# Altium schematic sheet Sche_Main.SchDoc
size B
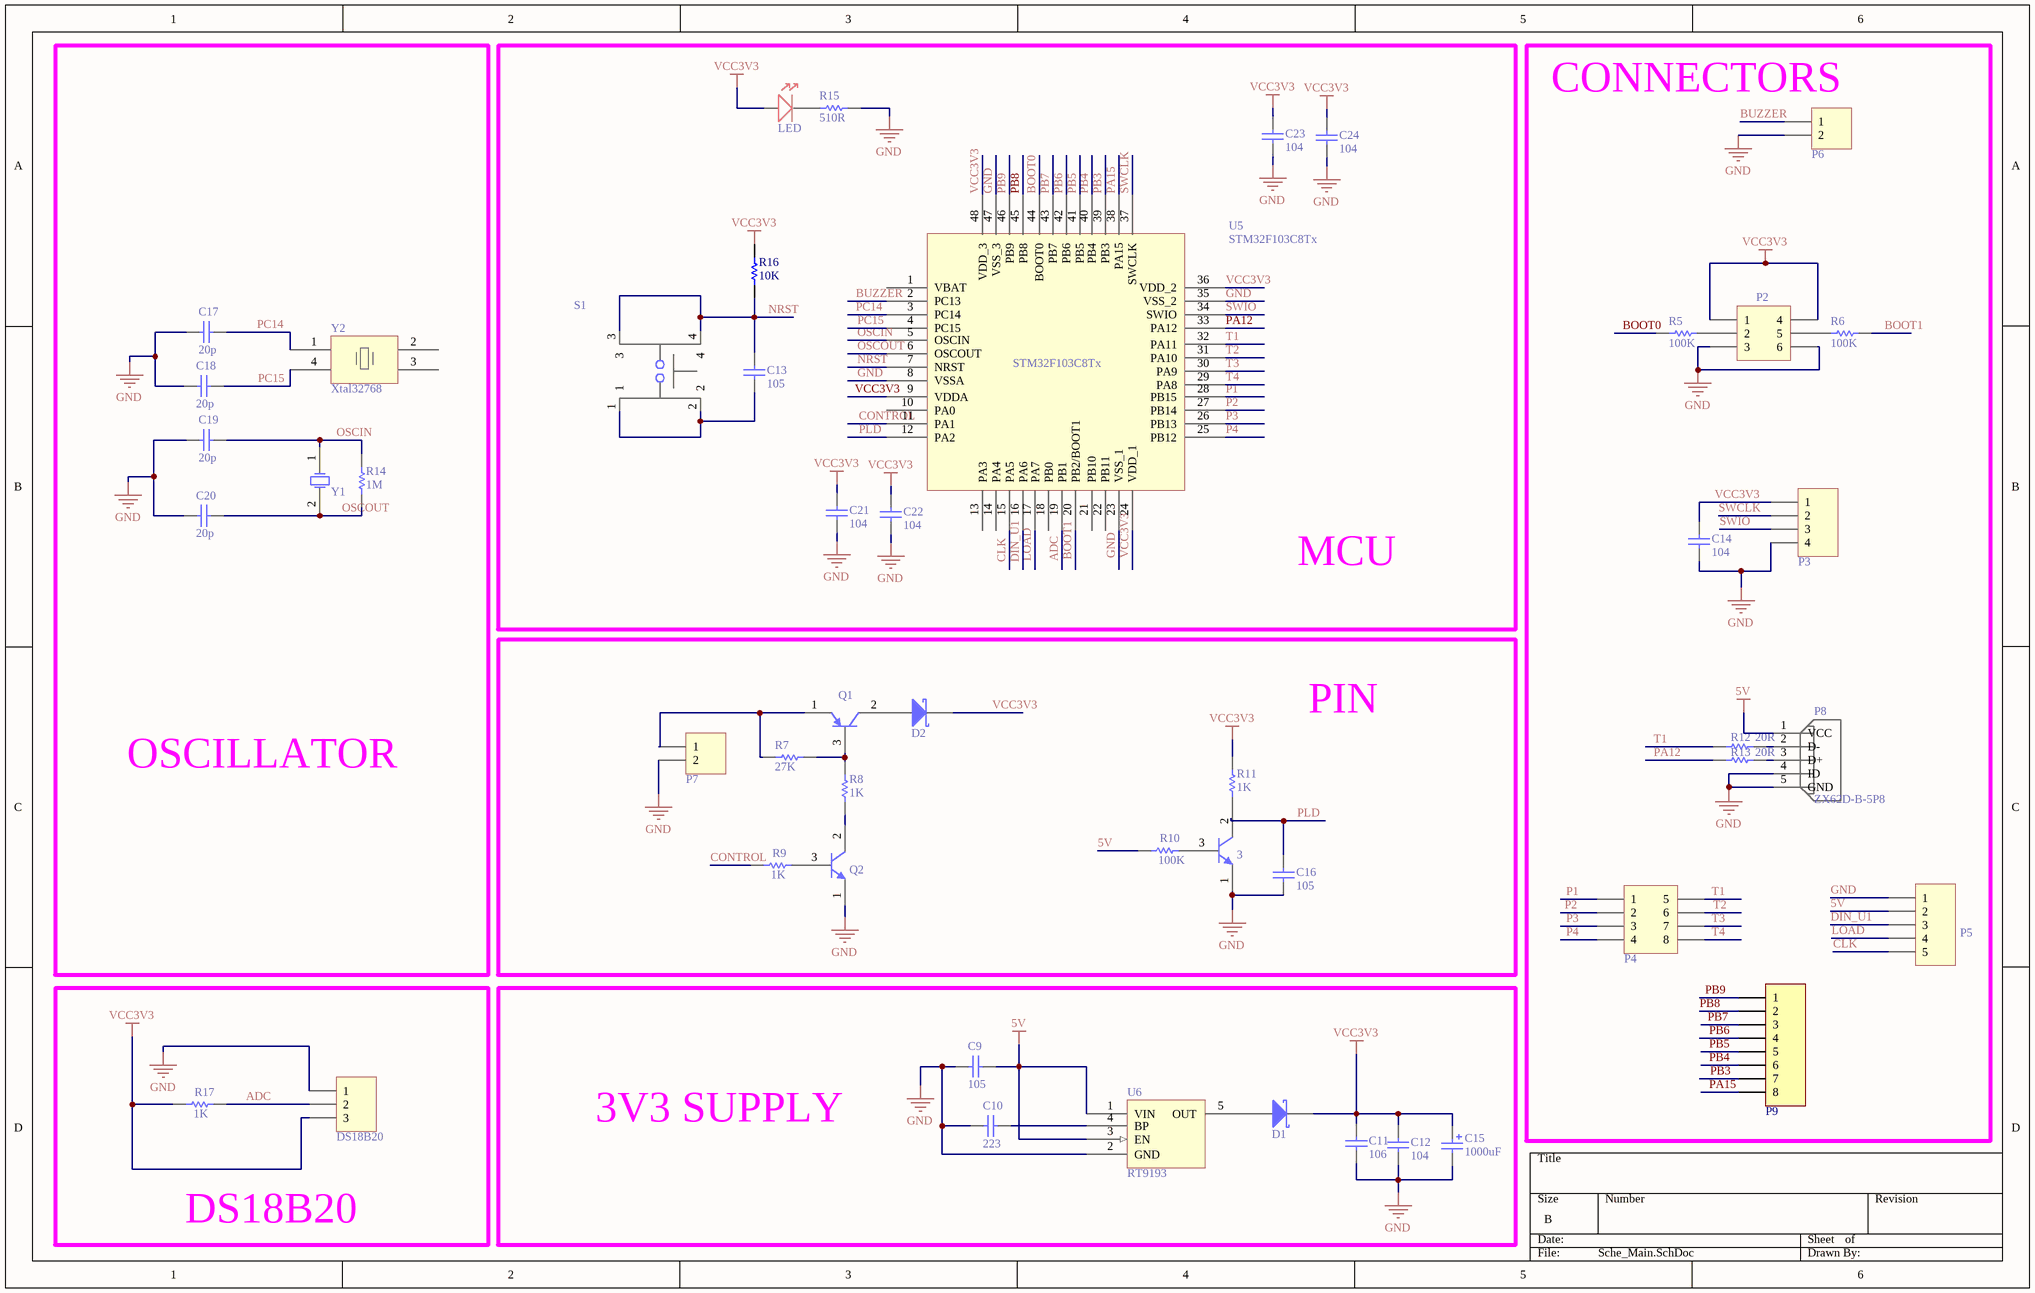
[diagram p0: Sche_Main.SchDoc]

## Parts
3  C1815  [SOT23B]  (value not drawn)
C9  value 105  [CAP-SM-0805]  (hidden comment: Cap Non-Pol SMD)
C10  value 223  [CAP-SM-0805]  (hidden comment: Cap Non-Pol SMD)
C11  value 106  [CAP-SM-0805]  (hidden comment: Cap Non-Pol SMD)
C12  value 104  [CAP-SM-0805]  (hidden comment: Cap Non-Pol SMD)
C13  value 105  [CAP-SM-0805]  (hidden comment: Cap Non-Pol SMD)
C14  value 104  [CAP-SM-0805]  (hidden comment: Cap Non-Pol SMD)
C15  value 1000uF  [CAP ALU SIZE B]  (hidden comment: Cap Pol SMD)
C16  value 105  [CAP-SM-0805]  (hidden comment: Cap Non-Pol SMD)
C17  value 20p  [CAP-SM-0805]  (hidden comment: Cap Non-Pol SMD)
C18  value 20p  [CAP-SM-0805]  (hidden comment: Cap Non-Pol SMD)
C19  value 20p  [CAP-SM-0805]  (hidden comment: Cap Non-Pol SMD)
C20  value 20p  [CAP-SM-0805]  (hidden comment: Cap Non-Pol SMD)
C21  value 104  [CAP-SM-0805]  (hidden comment: Cap Non-Pol SMD)
C22  value 104  [CAP-SM-0805]  (hidden comment: Cap Non-Pol SMD)
C23  value 104  [CAP-SM-0805]  (hidden comment: Cap Non-Pol SMD)
C24  value 104  [CAP-SM-0805]  (hidden comment: Cap Non-Pol SMD)
D1  D Schottky  [SS34]  (value not drawn)
D2  D Schottky  [SS34]  (value not drawn)
DS18B20  Header 3  [QTO-92]  (value not drawn)
LED  KA-3528EC  [DIOM3228X21N]  (value not drawn)
P2  Header 3X2  [JP3x2]  (value not drawn)
P3  Header 4  [JP4]  (value not drawn)
P4  Header 4X2  [JP4x2]  (value not drawn)
P5  Header 5  [JP5]  (value not drawn)
P6  Domino 2  [DOMINO 2- 5mm]  (value not drawn)
P7  Header 2  [JP2]  (value not drawn)
P8  ZX62D-B-5P8  [HRS_ZX62D-B-5P8]
P9  Header 8  [JP8]  (value not drawn)
Q1  A1015  [SOT23B]  (value not drawn)
Q2  C1815  [SOT23B]  (value not drawn)
R5  value 100K  [RES-SM-0805]  (hidden comment: RESISTOR SMD)
R6  value 100K  [RES-SM-0805]  (hidden comment: RESISTOR SMD)
R7  value 27K  [RES-SM-0805]  (hidden comment: RESISTOR SMD)
R8  value 1K  [RES-SM-0805]  (hidden comment: RESISTOR SMD)
R9  value 1K  [RES-SM-0805]  (hidden comment: RESISTOR SMD)
R10  value 100K  [RES-SM-0805]  (hidden comment: RESISTOR SMD)
R11  value 1K  [RES-SM-0805]  (hidden comment: RESISTOR SMD)
R12  value 20R  [RES-SM-0805]  (hidden comment: RESISTOR SMD)
R13  value 20R  [RES-SM-0805]  (hidden comment: RESISTOR SMD)
R14  value 1M  [RES-SM-0805]  (hidden comment: RESISTOR SMD)
R15  value 510R  [RES-SM-0805]  (hidden comment: RESISTOR SMD)
R16  value 10K  [RES-SM-0805]  (hidden comment: RESISTOR SMD)
R17  value 1K  [RES-SM-0805]  (hidden comment: RESISTOR SMD)
S1  TL3342F160QG  [SW_TL3342F160QG]  (value not drawn)
U5  STM32F103C8Tx  [TSQFP50P900X900X160-48N]
U6  RT9193  [SOT95P279X129-5N]
Y1  XTAL  [XT2]  (value not drawn)
Y2  Xtal32768

## Blocks framed on the sheet
OSCILLATOR: C17-C20 R14 Y1 Y2
MCU: C13 C21-C24 LED R15 R16 S1 U5
CONNECTORS: C14 P2-P6 P8 P9 R5 R6 R12 R13
PIN: 3 C16 D2 P7 Q1 Q2 R7-R11
DS18B20: DS18B20 R17
3V3 SUPPLY: C9-C12 C15 D1 U6

## Nets
5V: C9.2 P5.2 P8.1(VCC) R10.1 U6.1(VIN) U6.3(EN)
GND: 3.1(E) C9.1 C10.1 C11.1 C12.1 C14.1 C15.2 C16.1 C17.1 C18.1 C19.1 C20.1 C21.1 C22.1 C23.1 C24.1 DS18B20.1 P2.3 P2.6 P3.4 P5.1 P6.2 P7.2 P8.4(ID) P8.5(GND) Q2.1(E) R15.2 U5.8(VSSA) U5.23(VSS_1) U5.35(VSS_2) U5.47(VSS_3) U6.2(GND)
VCC3V3: C11.2 C12.2 C14.2 C15.1 C21.2 C22.2 C23.2 C24.2 D1.2(K) D2.2(K) DS18B20.3 LED.1 P2.1 P2.4 P3.1 R11.2 R16.2 R17.1 U5.9(VDDA) U5.24(VDD_1) U5.36(VDD_2) U5.48(VDD_3)
ADC: DS18B20.2 R17.2 U5.19(PB1)
BOOT0: R5.1 U5.44(BOOT0)
BOOT1: R6.2 U5.20(PB2/BOOT1)
BUZZER: P6.1 U5.2(PC13)
CLK: P5.5 U5.15(PA5)
CONTROL: R9.1 U5.11(PA1)
DIN_U1: P5.3 U5.16(PA6)
LOAD: P5.4 U5.17(PA7)
NRST: C13.2 R16.1 S1.3 S1.4 U5.7(NRST)
OSCIN: C19.2 R14.2 U5.5(OSCIN) Y1.1(OSC1)
OSCOUT: C20.2 R14.1 U5.6(OSCOUT) Y1.2(OSC2)
P1: P4.1 U5.28(PB15)
P2: P4.2 U5.27(PB14)
P3: P4.3 U5.26(PB13)
P4: P4.4 U5.25(PB12)
PA12: R13.1 U5.33(PA12)
PA15: P9.8 U5.38(PA15)
PB3: P9.7 U5.39(PB3)
PB4: P9.6 U5.40(PB4)
PB5: P9.5 U5.41(PB5)
PB6: P9.4 U5.42(PB6)
PB7: P9.3 U5.43(PB7)
PB8: P9.2 U5.45(PB8)
PB9: P9.1 U5.46(PB9)
PC14: C17.2 U5.3(PC14) Y2.1
PC15: C18.2 U5.4(PC15) Y2.4
PLD: C16.2 U5.12(PA2)
SWCLK: P3.2 U5.37(SWCLK)
SWIO: P3.3 U5.34(SWIO)
T1: P4.5 R12.1 U5.32(PA11)
T2: P4.6 U5.31(PA10)
T3: P4.7 U5.30(PA9)
T4: P4.8 U5.29(PA8)
Net3_2: 3.2(C) R11.1
Net3_3: 3.3(B) R10.2
NetC10_2: C10.2 U6.4(BP)
NetC13_1: C13.1 S1.1 S1.2
NetD1_1: D1.1(A) U6.5(OUT)
NetD2_1: D2.1(A) Q1.2(C)
NetLED_2: LED.2 R15.1
NetP2_2: P2.2 R5.2
NetP2_5: P2.5 R6.1
NetP7_1: P7.1 Q1.1(E) R7.1
NetP8_2: P8.2(D-) R12.2
NetP8_3: P8.3(D+) R13.2
NetQ1_3: Q1.3(B) R7.2 R8.2
NetQ2_2: Q2.2(C) R8.1
NetQ2_3: Q2.3(B) R9.2

Not connected (* = marked no-connect by the designer): U5 1(VBAT) 10(PA0) 13(PA3) 14(PA4) 18(PB0) 21(PB10) 22(PB11); Y2 2 3

## Library data of the parts
3 Q2 = C1815: NPN Bipolar Transistor
C9-C14 C16-C24 = Cap Non-Pol SMD: Capacitor
C15 = Cap Pol SMD: Polarized Capacitor (Radial)
D1 D2 = D Schottky: Schottky Diode; Published: 8-Jun-2000; LatestRevisionDate: 17-Jul-2002; LatestRevisionNote: Re-released for DXP Platform.; PackageReference: SMB; Publisher: Altium Limited; PackageDescription: DO-214-AA/SMB; 2 C-Bend Leads; Body 5.3 x 3.6 mm, inc. leads (LxW); Code_JEDEC: DO-214-AA
DS18B20 = Header 3: Header, 3-Pin; LatestRevisionDate: 17-Jul-2002; LatestRevisionNote: Re-released for DXP Platform.; Publisher: Altium Limited
LED = LED_3528: KINGBRIGHT         KA-3528EC             LED, Red, SMD, 2.4mm, 20 mA, 2 V, 627 nm; Rad Hard: No; Number of LEDs: 1; Intensity: 40(Max) mcd; Peak Wavelength: 625 nm; Lens Appearance: Colorless Non Diffused; Lens Shape Type: Circular; Viewing Angle: 120 °; Mounting Orientation: Top Mount; Supplier 1: Farnell; Manufacturer: Kingbright; Manufacturer Part Number: KA-3528EC; Stock 1: 2196; Pricing 1: 5=0.372, 25=0.282, 100=0.232, 250=0.175, 500=0.15, 1000=0.134 (EUR); Package: 2SMD; Pin Count: 2; Type: Uni-Color; Color: Red; Mounting: Surface Mount; Category: LEDs; ComponentLink1URL: https://datasheet.ciiva.com/5785/1500240-5785780.pdf; ComponentLink1Description: https://datasheet.ciiva.com/5785/1500240-5785780.pdf; ComponentLink2URL: https://datasheet.ciiva.com/14176/bd254568-254571-14176482.pdf; ComponentLink2Description: https://datasheet.ciiva.com/14176/bd254568-254571-14176482.pdf; ComponentLink3URL: https://datasheet.ciiva.com/8060/1500240-8060332.pdf; ComponentLink3Description: https://datasheet.ciiva.com/8060/1500240-8060332.pdf; ComponentLink4URL: https://datasheet.ciiva.com/8060/1500240-8060331.pdf; ComponentLink4Description: https://datasheet.ciiva.com/8060/1500240-8060331.pdf; ComponentLink5URL: https://datasheet.ciiva.com/20166/72-8261-20166551.pdf; ComponentLink5Description: https://datasheet.ciiva.com/20166/72-8261-20166551.pdf; Supplier Part Number 1: 8530211
P2 = Header 3X2: Header, 3-Pin, Dual row; LatestRevisionDate: 17-Jul-2002; LatestRevisionNote: Re-released for DXP Platform.; Publisher: Altium Limited
P3 = Header 4: Header, 4-Pin; LatestRevisionDate: 17-Jul-2002; LatestRevisionNote: Re-released for DXP Platform.; Publisher: Altium Limited
P4 = Header 4X2: Header, 4-Pin, Dual row; LatestRevisionDate: 17-Jul-2002; LatestRevisionNote: Re-released for DXP Platform.; Publisher: Altium Limited
P5 = Header 5: Header, 5-Pin; LatestRevisionDate: 17-Jul-2002; LatestRevisionNote: Re-released for DXP Platform.; Publisher: Altium Limited
P6 = Domino 2: Domino, 2-Pin; LatestRevisionDate: 17-Jul-2002; LatestRevisionNote: Re-released for DXP Platform.; Publisher: Altium Limited
P7 = Header 2: Header, 2-Pin; LatestRevisionDate: 17-Jul-2002; LatestRevisionNote: Re-released for DXP Platform.; Publisher: Altium Limited
P8 = ZX62D-B-5P8: SMD+DIP Micro USB; MICRO-B-SMD; MF: Hirose; SnapEDA_Link: https://www.snapeda.com/parts/ZX62D-B-5P8/Hirose%20Electric%20Co%20Ltd/view-part/?ref=snap; Availability: Unavailable; Price: None; MP: ZX62D-B-5P8; Package: None; Value: *
P9 = Header 8: Header, 8-Pin; LatestRevisionDate: 17-Jul-2002; LatestRevisionNote: Re-released for DXP Platform.; Publisher: Altium Limited
Q1 = A1015: PNP Bipolar Transistor
R5-R17 = RESISTOR SMD: Resistor
S1 = TL3342F160QG: TL3342 Series SPST 1.6 N Round Button Gull Wing Surface Mount Tactile Switch; MF: E-Switch; SnapEDA_Link: https://www.snapeda.com/parts/TL3342F160QG/E-Switch/view-part/?ref=snap; Package: None; MP: TL3342F160QG; Availability: Good; Price: 0.41 USD; Value: *
U5 = STM32F103C8Tx: MCU 32-bit STM32F ARM Cortex M3 RISC 64KB Flash 2.5V/3.3V 48-Pin LQFP Tray; Manufacturer: STMicroelectronics; Manufacturer Part Number: STM32F103C8T6; Data Bus Width: 32bit; Maximum Frequency: 72MHz; RAM Size: 20 kB; USB Channels: 1 x Device; Number of PWM Units: 1; ADC Channels: 10; Number of SPI Channels: 2; Typical Operating Supply Voltage: 2 → 3.6 V; Pulse Width Modulation: 1(16 bit) (Motor Control); Timers: 3 x 16 bit; Timer Resolution: 16bit; ADC Resolution: 12bit; Number of Timers: 3; ADCs: 2(10 x 12 bit); Supplier 1: Digi-Key; Stock 1: 2771; Pricing 1: 1=6.06, 10=5.438, 100=4.4558, 500=3.7931, 1000=3.199 (USD); Family Name: STM32F; Package Type: LQFP; Mounting Type: Surface Mount; Pin Count: 48; Device Core: ARM Cortex M3; Program Memory Size: 64 kB; Length: 7.2mm; Dimensions: 7.2 x 7.2 x 1.45mm; Number of ADC Units: 2; Number of USART Channels: 3; PWM Resolution: 16bit; Instruction Set Architecture: RISC; Height: 1.45mm; Maximum Operating Temperature: +85 °C; Number of I2C Channels: 2; Width: 7.2mm; Program Memory Type: Flash; Minimum Operating Temperature: -40 °C; Number of CAN Channels: 1; ComponentLink1URL: https://datasheet.ciiva.com/16210/cd00161566-16210248.pdf; ComponentLink1Description: https://datasheet.ciiva.com/16210/cd00161566-16210248.pdf; ComponentLink2URL: https://datasheet.ciiva.com/14100/pustm-arm-microcont-stm32f103-en-14100508.pdf; ComponentLink2Description: https://datasheet.ciiva.com/14100/pustm-arm-microcont-stm32f103-en-14100508.pdf; ComponentLink3URL: https://datasheet.ciiva.com/15122/getdatasheetpartid-69880-15122076.pdf; ComponentLink3Description: https://datasheet.ciiva.com/15122/getdatasheetpartid-69880-15122076.pdf; ComponentLink4URL: https://datasheet.ciiva.com/8054/1730126-8054942.pdf; ComponentLink4Description: https://datasheet.ciiva.com/8054/1730126-8054942.pdf; ComponentLink5URL: https://datasheet.ciiva.com/48687/001075658-da-01-en-mcu-64kb-mem-stm32f103c8t6-lqfp-48-stm-48687589.pdf; ComponentLink5Description: https://datasheet.ciiva.com/48687/001075658-da-01-en-mcu-64kb-mem-stm32f103c8t6-lqfp-48-stm-48687589.pdf; ComponentLink6URL: https://datasheet.ciiva.com/26816/stm32f103c8t6-26816902.pdf; ComponentLink6Description: https://datasheet.ciiva.com/26816/stm32f103c8t6-26816902.pdf; Supplier Part Number 1: 497-6063-ND
U6 = RT9193: RICHTEK         RT9193-15GB            IC, LDO, FIXED, 1.5V, 0.3A, SOT-23-5; Input Voltage Min: 2.5V; Input Voltage Max: 5.5V; Output Current: 300mA; LDO Regulator Case Style: SOT-23; No. of Pins: 5Pins; SVHC: No SVHC (17-Dec-2015); Supplier 1: Newark; Manufacturer: Richtek; Stock 1: 2999; Output Voltage Nom.: 1.5V; Operating Temperature Min: -40°C; Operating Temperature Max: 85°C; Packaging: Each; ComponentLink1URL: http://www.farnell.com/datasheets/1720535.pdf; ComponentLink1Description: http://www.farnell.com/datasheets/1720535.pdf; ComponentLink2URL: http://www.richtek.com/assets/product_file/RT9193/DS9193-16.pdf; ComponentLink2Description: http://www.richtek.com/assets/product_file/RT9193/DS9193-16.pdf; Supplier Part Number 1: 42AC0083; Manufacturer Part Number: RT9193-15GB
Y1 = XTAL: Crystal Oscillator; Published: 8-Jun-2000; LatestRevisionDate: 17-Jul-2002; LatestRevisionNote: Re-released for DXP Platform.; PackageReference: R38; Publisher: Altium Limited; PackageDescription: Crystal, Thru-Hole; 2 Leads; Body 3.1 x 8.2 mm (Dia.xH)